# Altium schematic sheet mcu.SchDoc
size A4
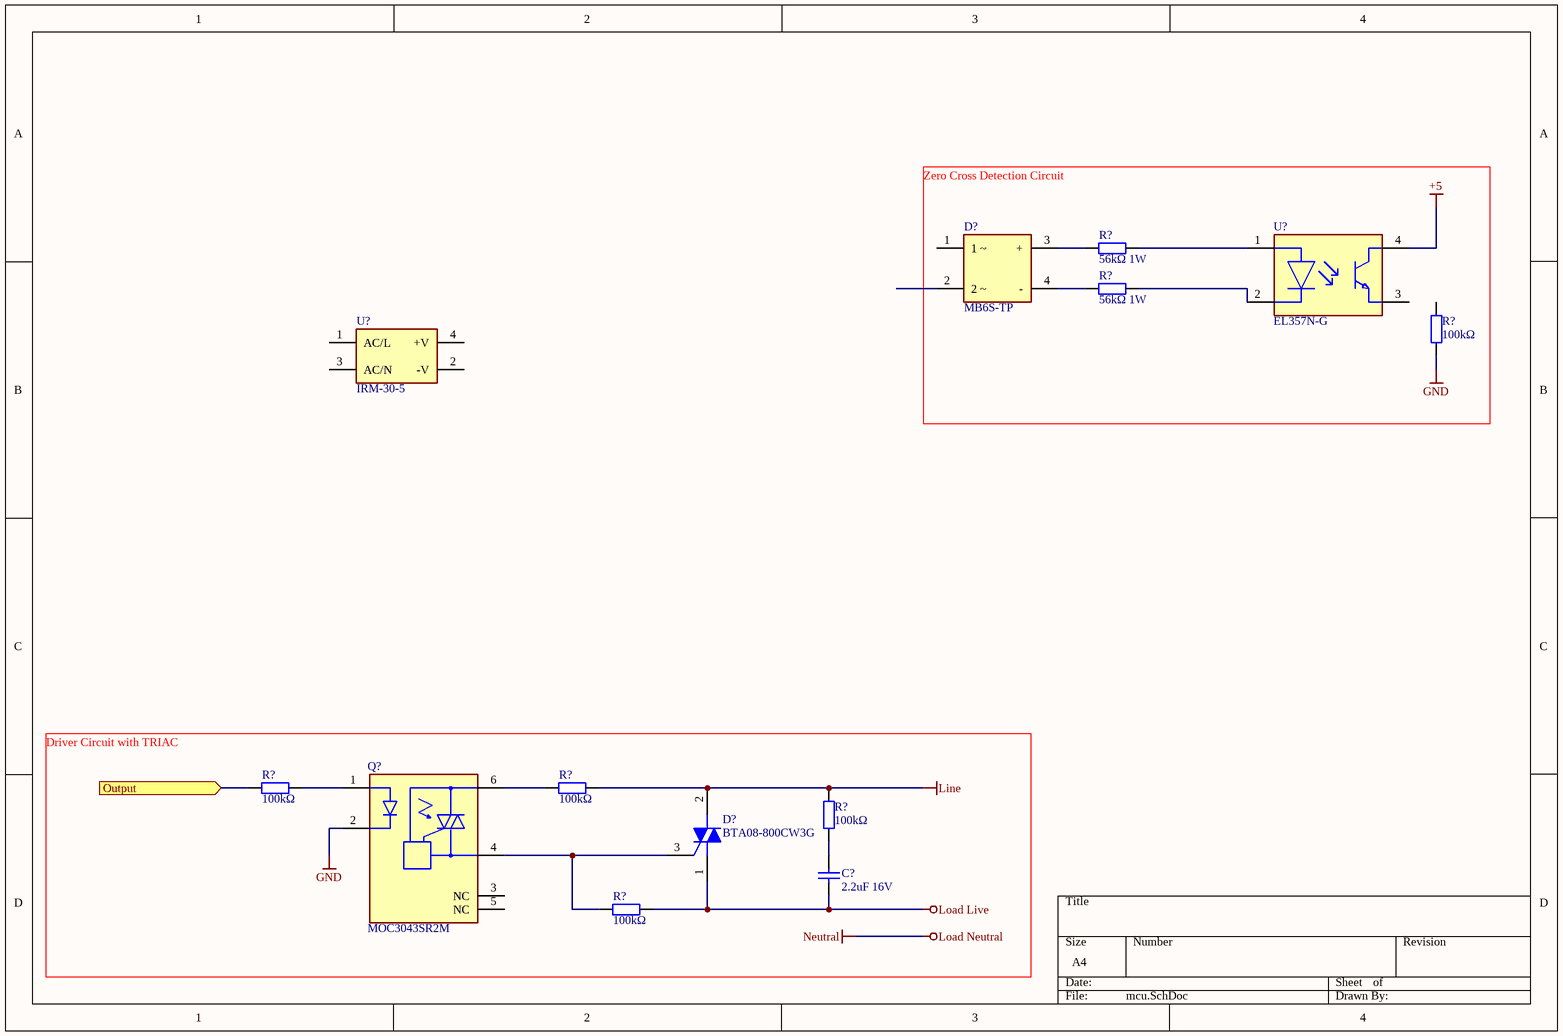
[diagram p0: mcu.SchDoc]

## Parts
(Parts that share a designator on the sheet are numbered #1, #2 ... from top to bottom, then left to right.)
C?  2.2uF 16V  [CAP_0805]
D?#1  MB6S-TP  [FP-MBS-1-MFG]
D?#2  BTA08-800CW3G  [ONSC-TO-220-3-221A-07]
Q?  MOC3043SR2M  [FP-646BY-MFG]
R?#1  56kΩ 1W  [RES_0805]
R?#2  56kΩ 1W  [RES_0805]
R?#3  100kΩ  [RES_0805]
R?#4  100kΩ  [RES_0805]
R?#5  100kΩ  [RES_0805]
R?#6  100kΩ  [RES_0805]
R?#7  100kΩ  [RES_0805]
U?#1  EL357N-G  [SOP-4_4mm]
U?#2  IRM-30-5  [FP-IRM-30-5-MFG]

## Ports
Output (in)

## Nets
+5: U?#1.4(C)
GND: Q?.2(C) R?#3.1
Line: D?#2.2(MT2) R?#5.1 R?#6.1
Load Live: C?.1 D?#2.1(MT1) R?#7.1
Output: R?#4.2 ; port Output
NetC?_2: C?.2 R?#6.2
NetD?#1_3: D?#1.3(+) R?#1.1
NetD?#1_4: D?#1.4(-) R?#2.1
NetD?#2_3: D?#2.3(G) Q?.4(1_MAIN_TERM.) R?#7.2
NetQ?_1: Q?.1(A) R?#4.1
NetQ?_6: Q?.6(2_MAIN_TERM.) R?#5.2
NetR?#1_2: R?#1.2 U?#1.1(A)
NetR?#2_2: R?#2.2 U?#1.2(C)

Not connected (* = marked no-connect by the designer): D?#1 1(1_~) 2(2_~); Q? 3(NC) 5(NC); R?#3 2; U?#1 3(E); U?#2 1(AC/L) 2(-V) 3(AC/N) 4(+V)

## Notes on the sheet
- Zero Cross Detection Circuit
- Driver Circuit with TRIAC

## Library data of the parts
C? = CAP_2.2uF_0805: Cap Ceramic 2.2uF 16V X7R 10% Pad SMD 0805 Soft Termination 125C Automotive T/R; Manufacturer: Murata; Manufacturer Part Number: GCJ21BR71C225KA13L; Supplier 1: Mouser; RoHS: Yes; Category: Ceramic Capacitors; Stock 1: 34901; Pricing 1: 1=0.49000, 10=0.34200, 50=0.34200, 100=0.20500, 500=0.15400, 1000=0.13000, 3000=0.12200, 6000=0.11600, 10000=0.11600 (USD); Mount: Surface Mount; Case/Package: 0805; Case Code (Metric): 2012; Case Code (Imperial): 0805; Min Operating Temperature: -55°C; Max Operating Temperature: 125°C; Capacitance: 2.2uF; Tolerance: 10%; Packaging: Tape and Reel; Voltage Rating: 16V; Dielectric: X7R; Voltage Rating (DC): 16V; Package Quantity: 1; Termination: SMD/SMT; Series: GCJ; Construction: Flat; Features: Soft Termination; Length: 2mm; Width: 0.049inch; Height: 1.25mm; Thickness: 0.057inch; Depth: 1.25mm; Ratings: AEC-Q200; Radiation Hardening: No; RoHS Compliant: Yes; Lead Free: Lead Free; ComponentLink1URL: https://datasheet.ciiva.com/172/product-172726.pdf?src-supplier=Digi-Key; ComponentLink1Description: https://datasheet.ciiva.com/172/product-172726.pdf?src-supplier=Digi-Key; ComponentLink2URL: https://datasheet.ciiva.com/172/s0717e-172727.pdf?src-supplier=Digi-Key; ComponentLink2Description: https://datasheet.ciiva.com/172/s0717e-172727.pdf?src-supplier=Digi-Key; ComponentLink3URL: https://datasheet.ciiva.com/172/s0717e-172728.pdf?src-supplier=Digi-Key; ComponentLink3Description: https://datasheet.ciiva.com/172/s0717e-172728.pdf?src-supplier=Digi-Key; Supplier Part Number 1: 81-GCJ21BR71C225KA3L
D?#1 = CMP-56207-000002-1: BRIDGE RECT 1P 600V 500MA MBS-1; Manufacturer: MCC; Value: 13pF; Max Surge Forward Current: 35A; Standoff Height: 0.05mm; Max Junction Temp: +150°C; Forward Current: 0.5A; Peak Reverse Current: 5uA; Temperature: -55°C to +150°C; Temperature Range High: +150°C; Package: MBS-1; Temperature Range Low: -55°C; Octopart: https://octopart.com/mb6s-tp-mcc-733391; Max Repetitive Reverse Voltage: 600V; Mouser Description: Bridge Rectifiers .5A 600V; ComponentLink2URL: https://www.mccsemi.com/pdf/Products/MB05S-MB10S(MBS-1)-H.pdf; Reverse Voltage: 600V; ComponentLink2Description: Datasheet; Height: 2.9mm; Manufacturer Part Number: MB6S-TP; Lead Free: Yes; RoHS: TRUE; Category: Diode; Device Class L2: Diodes; Digikey Description: BRIDGE RECT 1P 600V 500MA MBS-1; Device Class L1: Discrete Semiconductors; Automotive: No; Device Class L3: Rectifier Diodes; Capacitance: 13pF
D?#2 = CMP-1070-00054-1: Triacs, Silicon Bidirectional Thyristor, 3-Pin TO-220, Pb-Free, Tube; Manufacturer: On Semiconductor; ITSM Max (A): 90; IT(RMS) Max (A): 8; IGT Max (mA): 35; ComponentLink2Description: Datasheet; PackageVersion: Rev. O, 07/2008; DatasheetVersion: Rev. 0; ComponentLink1Description: Manufacturer URL; Packing: Tube; PackageDescription: 3-Pin Flange Mount, Vertical Straight Lead, Body 9.97 x 4.445 mm, Pitch 2.54 mm; Mounting Technology: Through Hole; PackageReference: TO-220-3-221A-07; ComponentLink3Description: Package Specification; RoHS: Pb-Free; PartNumber: BTA08-800CW3G; ComponentLink1URL: http://www.onsemi.com/; ComponentLink3URL: http://www.onsemi.com/pub_link/Collateral/221A-07.PDF; ComponentLink2URL: http://www.onsemi.com/pub_link/Collateral/BTA08-800CW3-D.PDF
Q? = CMP-07144-000011-2: OPTOISOLATOR 4.17KV TRIAC 6SMD; Forward Voltage: 1.5V; Approvals: UL; Number of Circuits: 1; Output Voltage: 400V; Nominal Input Voltage: 1.25V; Hold Current: 400uA; Forward Current: 60mA; Max Power Dissipation: 250mW; Reverse Breakdown Voltage: 6V; Isolation Voltage: 5.25kV; Radiation Hardening: No; Number of Pins: 6; Max Input Voltage: 1.5V; Case/Package: SMD/SMT; Mount: Surface Mount; REACH SVHC: No SVHC; Number of Channels: 1; Weight: 0.81g; Contact Plating: Tin; Min Operating Temperature: -40°C; Packaging: Tape and Reel; Max Input Current: 60mA; Lead Free: Lead Free; Power Dissipation: 250mW; Input Current: 60mA; Max Operating Temperature: 85°C; Package Quantity: 1; Number of Elements: 1
R?#1-R?#7 = RES_100kohm_0805: Res Thick Film 0805 100K Ohm 1% 0.125W(1/8W) ±100ppm/°C Molded SMD Punched Carrier T/R; Manufacturer: Panasonic; Manufacturer Part Number: ERJ-6ENF1003V; Resistance: 100kR; Max Power Dissipation: 125mW; Voltage Rating (DC): 150V; Supplier 1: Mouser; RoHS: Yes; Category: Chip SMD Resistors; Stock 1: 3449; Pricing 1: 1=0.11000, 10=0.08300, 50=0.08300, 100=0.03200, 1000=0.01400, 2500=0.01300, 5000=0.01000, 10000=0.01000 (USD); Mount: Surface Mount; Case/Package: 0805; Number of Pins: 2; Case Code (Metric): 2012; Case Code (Imperial): 0805; Contact Plating: Tin; Min Operating Temperature: -55°C; Max Operating Temperature: 155°C; Tolerance: 1%; Packaging: Tape and Reel; Number of Terminations: 2; Temperature Coefficient: 100ppm/°C; Resistor Type: Thick Film; Features: Automotive AEC-Q200; Power Rating: 125mW; Package Quantity: 1; Voltage Rating: 150V; Termination: SMD/SMT; Length: 2mm; Width: 0.049inch; Height: 0.6mm; Depth: 1.25mm; Radiation Hardening: No; Lead Free: Lead Free; Military Standard: Not; REACH SVHC: No SVHC; ComponentLink1URL: https://datasheet.ciiva.com/11821/0900766b80f80784-11821507.pdf?src-supplier=RSComponents; ComponentLink1Description: https://datasheet.ciiva.com/11821/0900766b80f80784-11821507.pdf?src-supplier=RSComponents; ComponentLink2URL: https://datasheet.ciiva.com/22723/426256-22723909.pdf?src-supplier=Element14; ComponentLink2Description: https://datasheet.ciiva.com/22723/426256-22723909.pdf?src-supplier=Element14; ComponentLink3URL: https://datasheet.ciiva.com/46419/1678782-46419877.pdf?src-supplier=Element14; ComponentLink3Description: https://datasheet.ciiva.com/46419/1678782-46419877.pdf?src-supplier=Element14; ComponentLink4URL: https://datasheet.ciiva.com/27055/1988989-27055734.pdf?src-supplier=Jameco; ComponentLink4Description: https://datasheet.ciiva.com/27055/1988989-27055734.pdf?src-supplier=Jameco; ComponentLink5URL: https://datasheet.ciiva.com/16449/aoa0000ce2-16449480.pdf?src-supplier=Future+Electronics; ComponentLink5Description: https://datasheet.ciiva.com/16449/aoa0000ce2-16449480.pdf?src-supplier=Future+Electronics; ComponentLink6URL: https://datasheet.ciiva.com/17208/aoa0000ce2-17208153.pdf?src-supplier=Avnet+Europe; ComponentLink6Description: https://datasheet.ciiva.com/17208/aoa0000ce2-17208153.pdf?src-supplier=Avnet+Europe; ComponentLink7URL: https://datasheet.ciiva.com/22667/1678782-22667897.pdf?src-supplier=Element14; ComponentLink7Description: https://datasheet.ciiva.com/22667/1678782-22667897.pdf?src-supplier=Element14; ComponentLink8URL: https://datasheet.ciiva.com/24023/aoa0000ce2-24023497.pdf?src-supplier=Mouser; ComponentLink8Description: https://datasheet.ciiva.com/24023/aoa0000ce2-24023497.pdf?src-supplier=Mouser; ComponentLink9URL: https://datasheet.ciiva.com/7830/426256-7830746.pdf?src-supplier=Element14; ComponentLink9Description: https://datasheet.ciiva.com/7830/426256-7830746.pdf?src-supplier=Element14; ComponentLink10URL: https://datasheet.ciiva.com/30257/aoa0000ce2-30257690.pdf?src-supplier=Onlinecomponents.com; ComponentLink10Description: https://datasheet.ciiva.com/30257/aoa0000ce2-30257690.pdf?src-supplier=Onlinecomponents.com; ComponentLink11URL: https://datasheet.ciiva.com/7830/426256-7830988.pdf?src-supplier=Element14; ComponentLink11Description: https://datasheet.ciiva.com/7830/426256-7830988.pdf?src-supplier=Element14; ComponentLink12URL: https://datasheet.ciiva.com/16776/70260748-16776892.pdf?src-supplier=Allied+Electronics; ComponentLink12Description: https://datasheet.ciiva.com/16776/70260748-16776892.pdf?src-supplier=Allied+Electronics; ComponentLink13URL: https://datasheet.ciiva.com/16788/70260748-16788734.pdf?src-supplier=Allied+Electronics; ComponentLink13Description: https://datasheet.ciiva.com/16788/70260748-16788734.pdf?src-supplier=Allied+Electronics; ComponentLink14URL: https://datasheet.ciiva.com/48531/aoa0000ce2-48531486.pdf?src-supplier=Avnet; ComponentLink14Description: https://datasheet.ciiva.com/48531/aoa0000ce2-48531486.pdf?src-supplier=Avnet; Supplier Part Number 1: 667-ERJ-6ENF1003V
U?#1 = OPTOCOUPLER_EL357N-G: 4 PIN SOP PHOTOTRANSISTOR PHOTOCOUPLER / CTR: 50~600% at IF =5mA, VCE =5V / 4 Pin SOP with a 2.0 mm profile; ComponentLink1Description: Datasheet; ComponentLink1URL: https://www.mouser.com/datasheet/2/143/201407061738295695-365680.pdf
U?#2 = CMP-28435-000001-1: AC/DC CONVERTER 5V 30W; Manufacturer: Mean Well; Output Type: Fixed; Switching Topology: Buck; Max Supply Voltage: 264V; Number Of Outputs: 1; Description: Miniature AC-DC Module type Power Supply 5 Volts 6 Amps 30 W; Switching Frequency: 65kHz; Nominal Supply Current: 0.5-0.75A; Min Supply Voltage: 85V; Output Current: 6A; Temperature: -30°C to +70°C; Device Class L1: Integrated Circuits (ICs); Temperature Range Low: -30°C; Temperature Range High: +70°C; ComponentLink2Description: Datasheet; Lead Free: Yes; Device Class L2: Power Management ICs; ComponentLink2URL: https://www.meanwell-web.com/content/files/pdfs/productPdfs/MW/IRM-30/IRM-30-spec.pdf; Mouser Description: 30W Encapsulated Board Mount Module AC/DC Power Supply with 5VDC Output; Automotive: No; Device Class L3: Voltage Regulators - Switching; Octopart: https://octopart.com/irm-30-5-mean+well-50976023; Category: IC; Package: IRM-30-5; Output Voltage: 5V; RoHS: TRUE; Manufacturer Part Number: IRM-30-5; Height: 24mm; Digikey Description: AC/DC CONVERTER 5V 30W